# EAGLE design SignalMast-Searchlight-SingleHead (EAGLE 7.7.0)
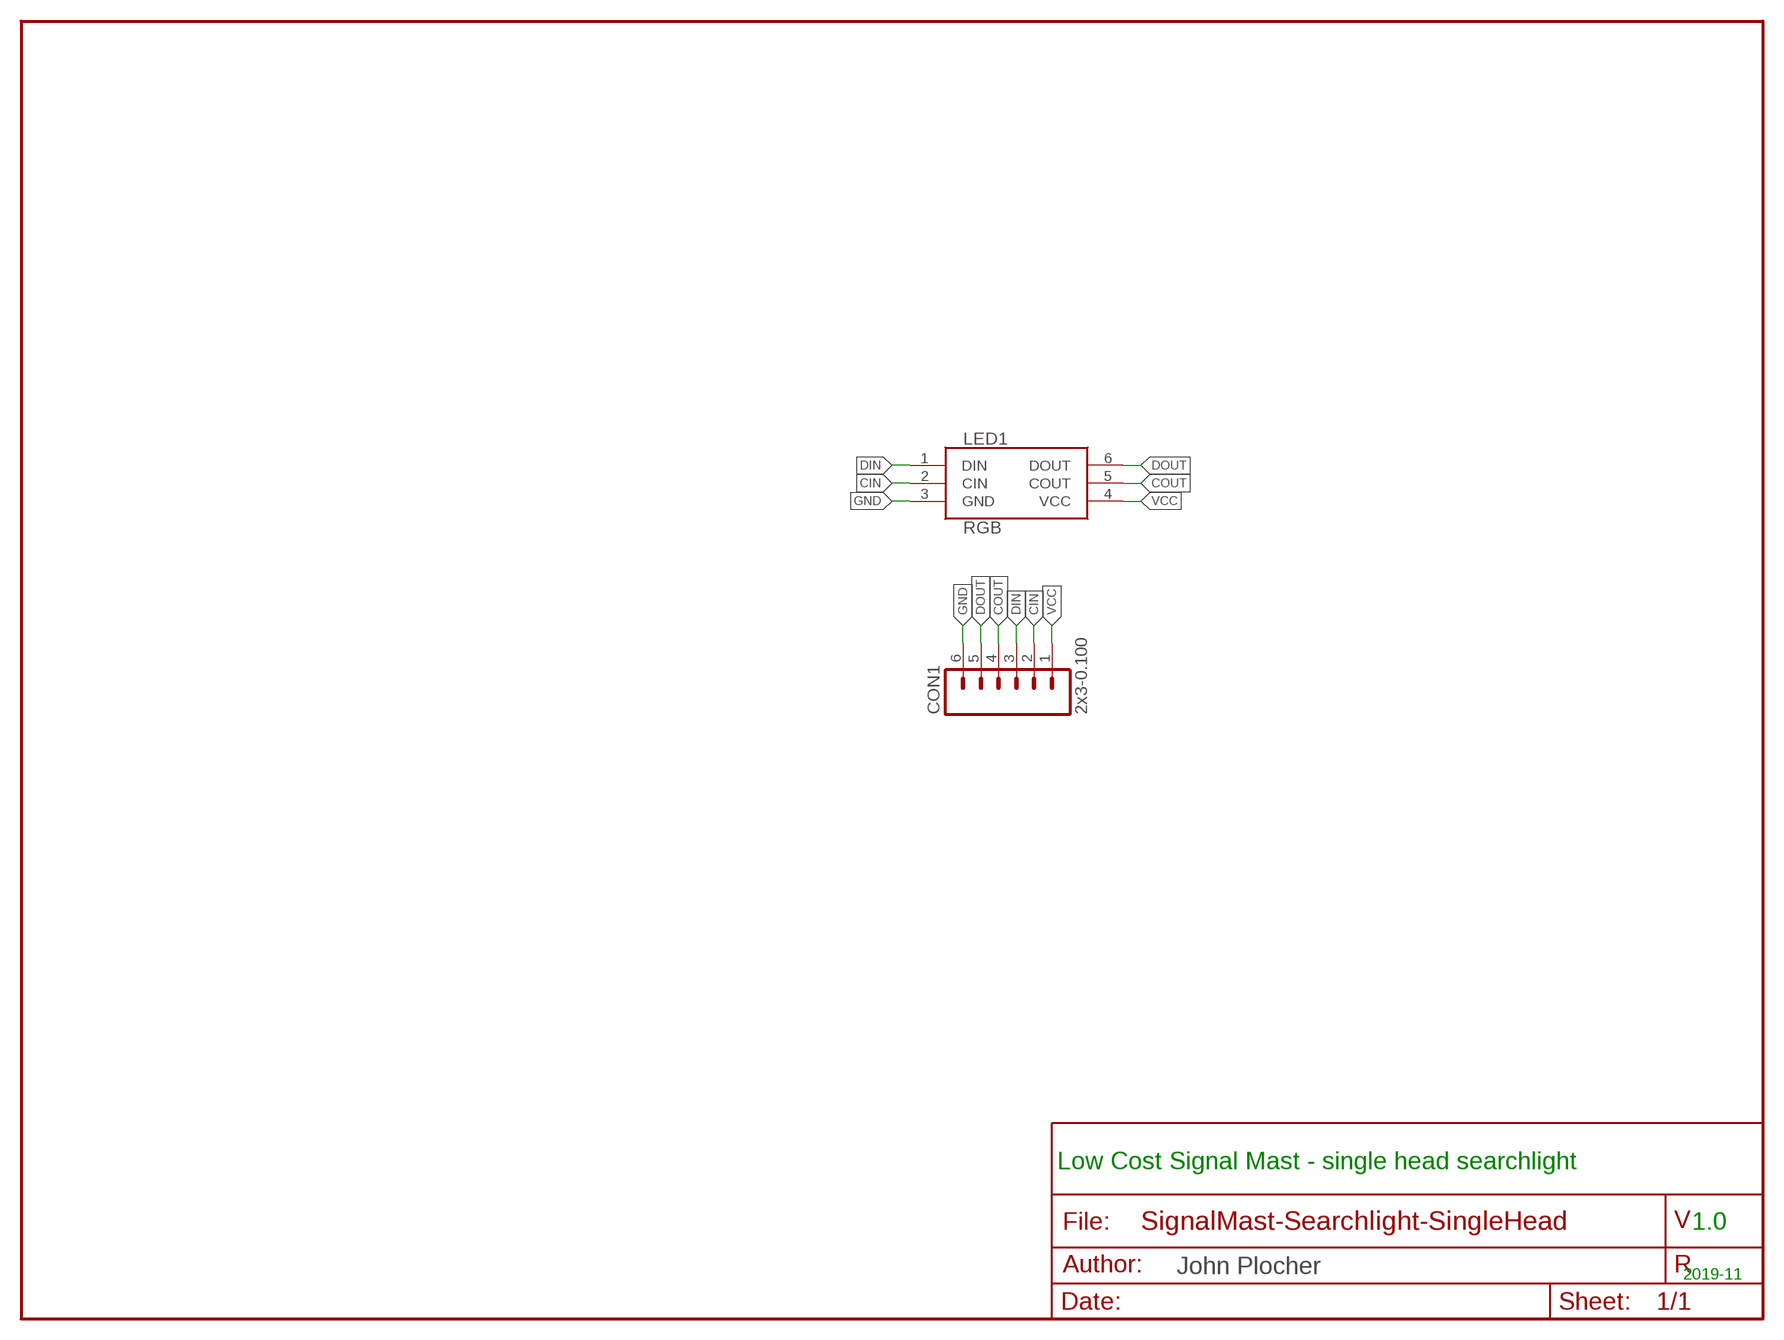
[diagram p0: schematic, sheet 1]

## Parts
CON1  2x3-0.100  CONNECTOR-M062X3-SMD  [2X3-SMD_EDGE]
LED1  RGB  LED-APA102  [APA102]

## Nets
CIN: CON1.2 LED1.2(CIN)
COUT: CON1.4 LED1.5(COUT)
DIN: CON1.3 LED1.1(DIN)
DOUT: CON1.5 LED1.6(DOUT)
GND: CON1.6 LED1.3(GND)
VCC: CON1.1 LED1.4(VCC)

## Notes on the sheet
- Low Cost Signal Mast - single head searchlight
- 1.0
- 2019-11

## Library data of the parts
CON1 = SPCoast:CONNECTOR-M06: Header 6 Standard 6-pin 0.1" header. Use with straight break away headers (SKU : PRT-00116), right angle break away headers (PRT-00553), swiss pins (PRT-00743), machine pins (PRT-00117), and female headers (PRT-00115). Molex polarized connector foot print use with SKU : PRT-08094 with associated crimp pins and housings. NOTES ON THE VARIANTS LOCK and LOCK_LONGPADS... This footprint was designed to help hold the alignment of a through-hole component (i.e. 6-pin header) while soldering it into place. You may notice that each hole has been shifted either up or down by 0.005 of an inch from it's more standard position (which is a perfectly straight line). This slight alteration caused the pins (the squares in the middle) to touch the edges of the holes. Because they are alternating, it causes a "brace" to hold the component in place. 0.005 has proven to be the perfect amount of "off-center" position when using our standard breakaway headers. Although looks a little odd when you look at the bare footprint, once you have a header in there, the alteration is very hard to notice. Also,if you push a header all the way into place, it is covered up entirely on the bottom side. This idea of altering the position of holes to aid alignment will be further integrated into the Sparkfun Library for other footprints. It can help hold any component with 3 or more connection pins.
LED1 = SPCoast:LED-APA102: SparkFun Accessories SMD LED - RGB APA102-2020 Source: Datasheet <https://componentsearchengine.com/Datasheets/1/COM-14608.pdf>; DESCRIPTION: SparkFun Accessories SMD LED - RGB APA102-2020; HEIGHT: 1mm; MANUFACTURER_NAME: SparkFun; MANUFACTURER_PART_NUMBER: COM-14608; MOUSER_PART_NUMBER: 474-COM-14608; MOUSER_PRICE-STOCK: https://www.mouser.com/Search/Refine.aspx?Keyword=474-COM-14608

## Net classes
0 default: width 0.203 mm

## Board
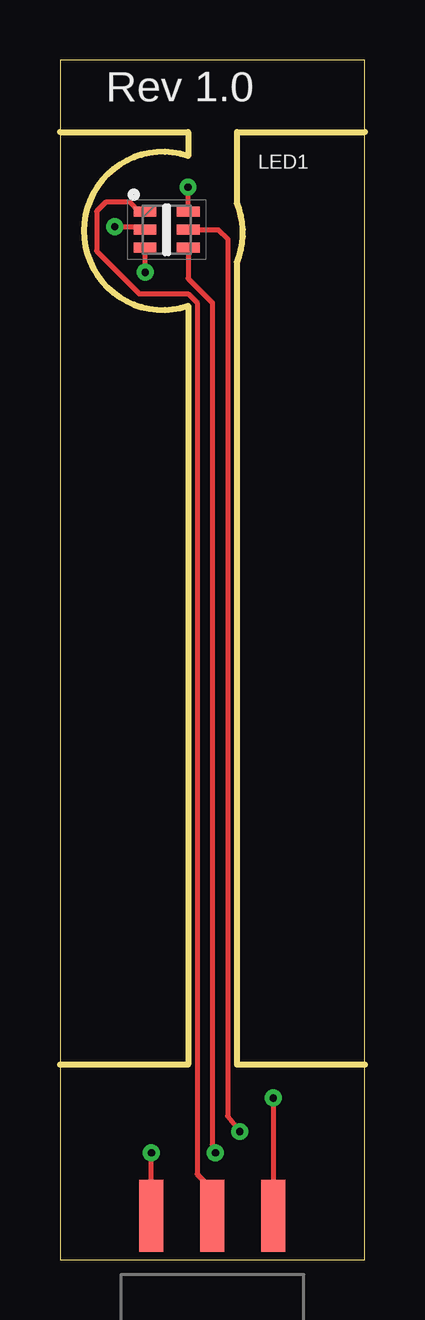
[diagram p1: board, top side]
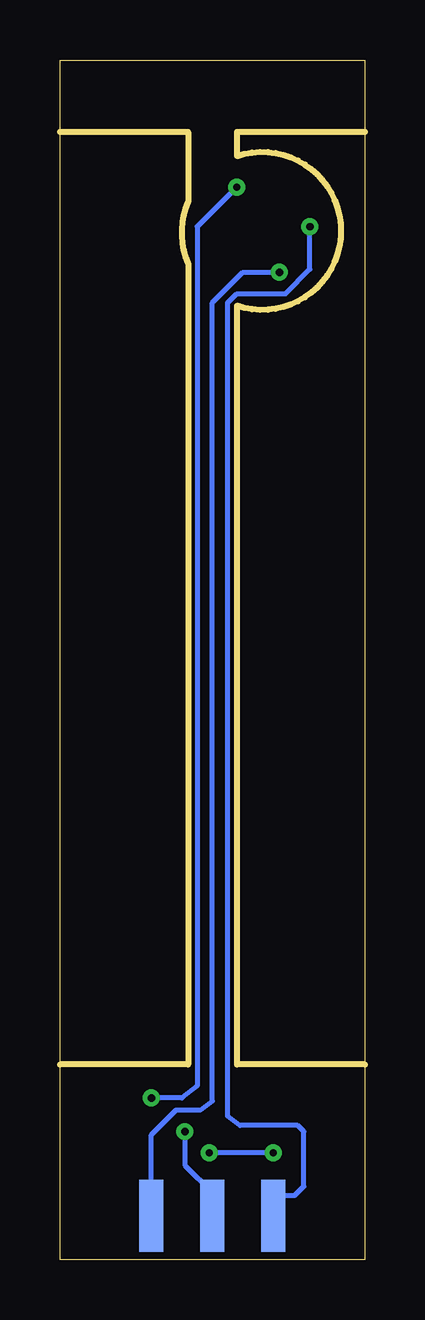
[diagram p2: board, bottom side, seen from below]

Size 12.7 x 50 mm. Coordinates in mm from the lower left corner, seen from the top.
Outline: 0,8.13 5.33,8.13 5.33,39.75 arc-217 5.33,46 5.33,46.99 0,46.99
Outline: 12.7,8.13 7.37,8.13 7.37,41.53 arc45 7.37,44.07 7.37,46.99 12.7,46.99
Outline: 0,0 12.7,0 12.7,50 0,50 0,0
Copper layers (1*16): Top 0.035mm / dielectric 1.5mm / Bottom 0.035mm
Design rules "default": minimum track width 10mil, minimum drill 24mil, track to track 8mil, track to pad 8mil, pad to pad 8mil, via to via 8mil, smd to smd 8mil, copper to edge 40mil, drill to drill 8mil, minimum pad ring 10mil, minimum via ring 8mil, stop-mask expansion 4mil, vias tented up to drill 0mil, thermal gap 10mil

### Footprints (pad centres in the part's own frame; a part is rotated, then mirrored left to right if it is on the bottom)
2X3-SMD_EDGE = smd 1 x 3: 1 -2.54,-0.08; 3 0,-0.08; 5 2.54,-0.08 | smd 1 x 3 bottom: 2 -2.54,-0.08; 4 0,-0.08; 6 2.54,-0.08
APA102 = smd 0.95 x 0.4: 1 -0.9,0.75; 2 -0.9,0; 3 -0.9,-0.75; 4 0.9,-0.75; 5 0.9,0; 6 0.9,0.75

### Placement (x,y rotation side)
CON1  6.35,1.91 0 top
LED1  4.45,42.93 0 top

### Tracks (layer width: path | path; a pad name or v marks a point on that pad's centre or on a via)
CIN  (via drill 0.3)
  Top 0.203: v2.29,43.05 3.42,43.05 LED1.2
  Bottom 0.203: CON1.2 3.81,2.67 2.92,2.67 2.54,3.05 2.54,5.33 2.79,5.59 5.21,5.59 5.71,5.97 5.71,39.88 5.33,40.26 3.3,40.26 2.29,41.27 v2.29,43.05
COUT  (via drill 0.3)
  Top 0.203: LED1.5 6.6,42.93 6.99,42.55 6.99,5.97 v7.49,5.33
  Bottom 0.203: v7.49,5.33 7.49,3.94 6.35,2.79 CON1.4
DIN
  Top 0.203: LED1.1 3.3,43.69 2.92,44.07 1.91,44.07 1.52,43.69 1.52,42.04 3.3,40.26 5.33,40.26 5.71,39.88 5.71,3.56 6.35,2.92 CON1.3
DOUT  (via drill 0.3)
  Top 0.203: LED1.6 5.33,43.69 v5.33,44.7 | v8.89,6.73 CON1.5
  Bottom 0.203: v5.33,44.7 6.99,43.05 6.99,7.24 7.62,6.73 v8.89,6.73
GND  (via drill 0.3)
  Top 0.203: v3.56,41.15 3.56,42.16 LED1.3
  Bottom 0.203: CON1.6 8.89,5.21 7.87,6.22 6.86,6.22 6.35,6.6 6.35,39.88 5.08,41.15 v3.56,41.15
VCC  (via drill 0.3)
  Top 0.203: CON1.1 v3.81,4.45 | LED1.4 5.33,42.16 5.33,40.89 6.35,39.88 6.35,4.83 v6.48,4.45
  Bottom 0.203: v3.81,4.45 v6.48,4.45

### Text on the board
tPlace: Rev 1.0
Document: Black Soldermask / White Silkscreen